# Altium schematic sheet MCU1.SchDoc
size A4; SheetNumber: 1; SheetTotal: 2
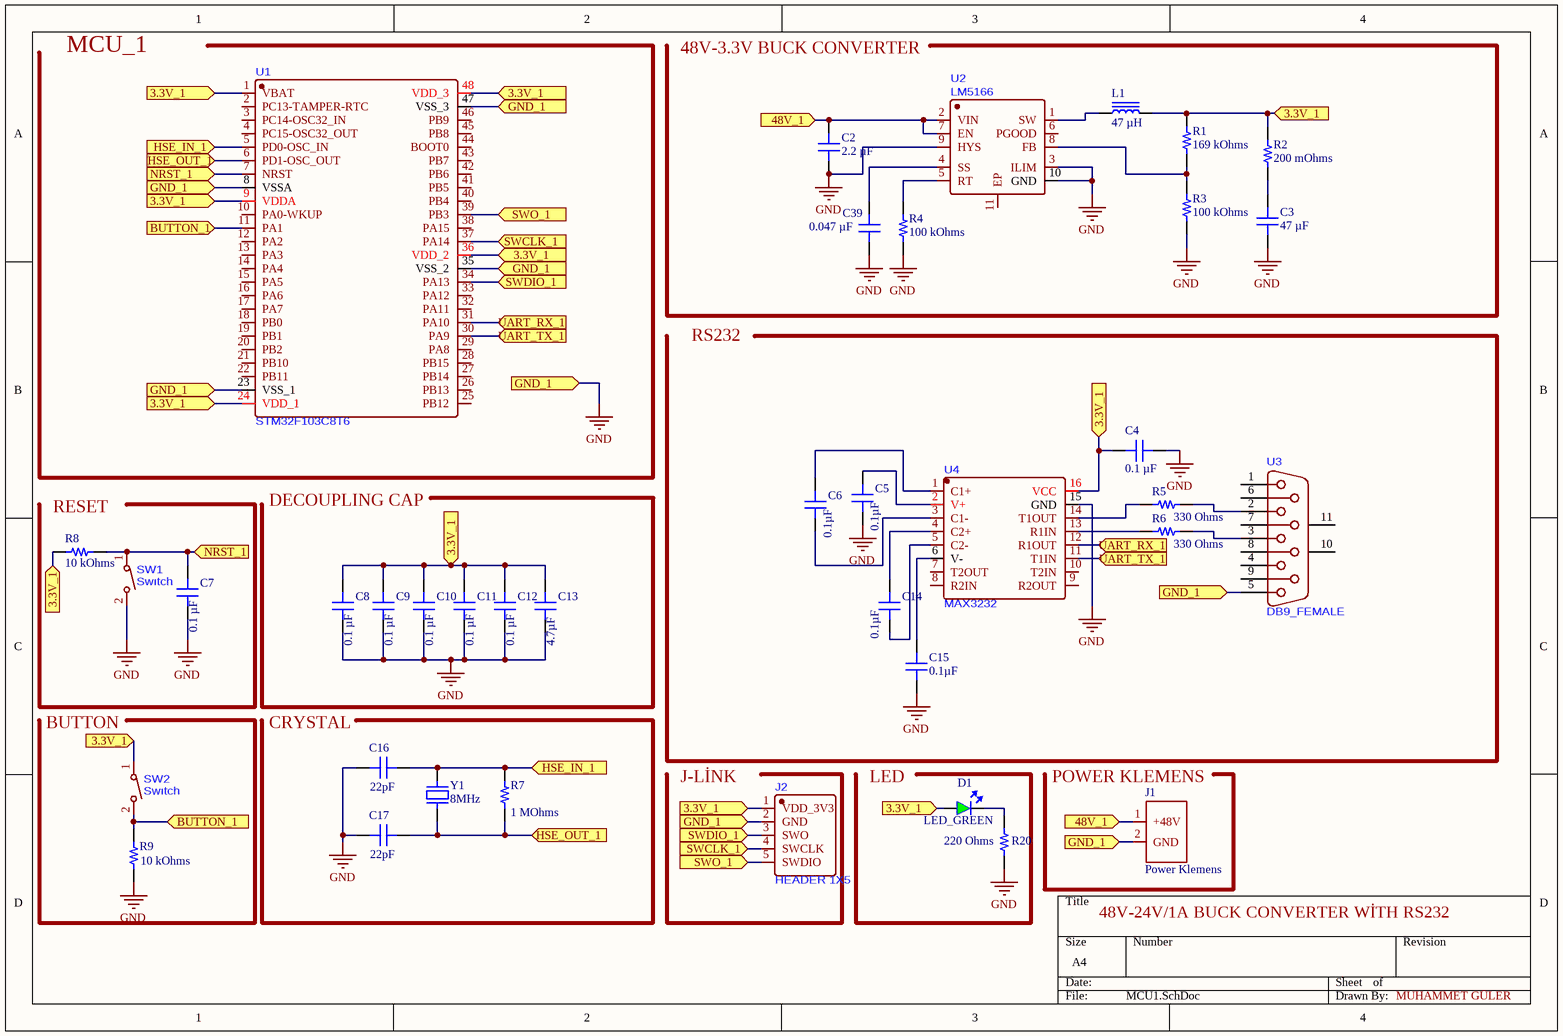
[diagram p0: MCU1.SchDoc]

## Parts
C2  2.2 µF  [CAP 1210_3225 - 1MM]
C3  47 µF  [CAP 1210_3225 - 1MM]
C4  0.1 µF  [CAP 0603_1608]
C5  0.1µF  [CAP 0603_1608]
C6  0.1µF  [CAP 0603_1608]
C7  0.1 µF  [CAP 0603_1608]
C8  0.1 µF  [CAP 0603_1608]
C9  0.1 µF  [CAP 0603_1608]
C10  0.1 µF  [CAP 0603_1608]
C11  0.1 µF  [CAP 0603_1608]
C12  0.1 µF  [CAP 0603_1608]
C13  4.7µF  [CAP 0603_1608]
C14  0.1µF  [CAP 0603_1608]
C15  0.1µF  [CAP 0603_1608]
C16  22pF  [CAP 0603_1608]
C17  22pF  [CAP 0603_1608]
C39  0.047 µF  [CAP 0402_1005]
D1  LED_GREEN  [LED_GREEN]
J1  Power Klemens  [PCBComponent_1]
J2  HEADER 1X5  [1X5-PIN-HEADER-2.54MM_ES]
L1  47 µH  [TAIYO YUDEN NRS8030]
R1  169 kOhms  [RES 0402_1005]
R2  200 mOhms  [RES 0402_1005]
R3  100 kOhms  [RES 0402_1005]
R4  100 kOhms  [RES 0402_1005]
R5  330 Ohms  [RES 0603_1608]
R6  330 Ohms  [RES 0603_1608]
R7  1 MOhms  [RES 0603_1608]
R8  10 kOhms  [RES 0603_1608]
R9  10 kOhms  [RES 0603_1608]
R20  220 Ohms  [RES 0603_1608]
SW1  Swıtch  [SW-SMD_L4.0-W3.0-LS5.0]
SW2  Swıtch  [SW-SMD_L4.0-W3.0-LS5.0]
U1  STM32F103C8T6  [UFQFPN-48_STM32]
U2  LM5166  [VSON-10_L3.0-W3.0-P0.50-TL-EP-1]
U3  DB9_FEMALE  [DB9-TH_DB9F_C5164093]
U4  MAX3232  [SOP-16_L9.9-W3.9-P1.27-LS6.0-BL]
Y1  8MHz  [NDK NX8045GB]

## Ports
3.3V_1 (in, see MCU1[1A], MCU1[1B], MCU1[1C], MCU1[2A], MCU1[2C], MCU1[2D], MCU1[3B], MCU1[3D]), 3.3V_1 (in, see MCU1[1A], MCU1[1B], MCU1[1C], MCU1[2A], MCU1[2C], MCU1[2D], MCU1[3B], MCU1[3D], MCU1[4A]), 3.3V_1 (in, see MCU1[1A], MCU1[1B], MCU1[1C], MCU1[2A], MCU1[2C], MCU1[2D], MCU1[3B], MCU1[4A]), 3.3V_1 (in, see MCU1[1A], MCU1[1B], MCU1[1C], MCU1[2A], MCU1[2C], MCU1[2D], MCU1[3D], MCU1[4A]), 3.3V_1 (in, see MCU1[1A], MCU1[1B], MCU1[1C], MCU1[2A], MCU1[2C], MCU1[3B], MCU1[3D], MCU1[4A]), 3.3V_1 (in, see MCU1[1A], MCU1[1B], MCU1[1C], MCU1[2A], MCU1[2D], MCU1[3B], MCU1[3D], MCU1[4A]), 3.3V_1 (in, see MCU1[1A], MCU1[1C], MCU1[2A], MCU1[2C], MCU1[2D], MCU1[3B], MCU1[3D], MCU1[4A]), 48V_1 (in, see MCU1[2A]), 48V_1 (in, see MCU1[3D]), BUTTON_1 (in, see MCU1[1A]), BUTTON_1 (in, see MCU1[1D]), GND_1 (in, see MCU1[1A], MCU1[1B], MCU1[2A], MCU1[2B], MCU1[2D], MCU1[3C]), GND_1 (in, see MCU1[1A], MCU1[1B], MCU1[2A], MCU1[2B], MCU1[2D], MCU1[3C], MCU1[3D]), GND_1 (in, see MCU1[1A], MCU1[1B], MCU1[2A], MCU1[2B], MCU1[2D], MCU1[3D]), GND_1 (in, see MCU1[1A], MCU1[1B], MCU1[2A], MCU1[2B], MCU1[3C], MCU1[3D]), GND_1 (in, see MCU1[1A], MCU1[1B], MCU1[2B], MCU1[2D], MCU1[3C], MCU1[3D]), GND_1 (in, see MCU1[1A], MCU1[2A], MCU1[2B], MCU1[2D], MCU1[3C], MCU1[3D]), GND_1 (in, see MCU1[1B], MCU1[2A], MCU1[2B], MCU1[2D], MCU1[3C], MCU1[3D]), HSE_IN_1 (in, see MCU1[1A]), HSE_IN_1 (in, see MCU1[2C]), HSE_OUT_1 (in, see MCU1[1A]), HSE_OUT_1 (in, see MCU1[2D]), NRST_1 (in, see MCU1[1A]), NRST_1 (in, see MCU1[1C]), SWCLK_1 (in, see MCU1[2A]), SWCLK_1 (in, see MCU1[2D]), SWDIO_1 (in, see MCU1[2B]), SWDIO_1 (in, see MCU1[2D]), SWO_1 (in, see MCU1[2A]), SWO_1 (in, see MCU1[2D]), UART_RX_1 (in, see MCU1[2B]), UART_RX_1 (in, see MCU1[3C]), UART_TX_1 (in, see MCU1[2B]), UART_TX_1 (in, see MCU1[3C])

## Nets
GND: C2.1 C3.1 C4.1 C5.1 C7.1 C8.1 C9.1 C10.1 C11.1 C12.1 C13.1 C15.1 C16.1 C17.1 C39.1 J1.2(GND) J2.2(GND) R3.1 R4.1 R9.1 R20.1 SW1.2 U1.8(VSSA) U1.23(VSS_1) U1.35(VSS_2) U1.47(VSS_3) U2.3(ILIM) U2.9(HYS) U2.10(GND) U3.5 U4.15(GND) ; port GND_1
3.3V_1: C4.2 C8.2 C9.2 C10.2 C11.2 C12.2 C13.2 D1.1(IN) J2.1(VDD_3V3) L1.2 R1.2 R2.2 R8.2 SW2.1 U1.1(VBAT) U1.9(VDDA) U1.24(VDD_1) U1.36(VDD_2) U1.48(VDD_3) U4.16(VCC) ; port 3.3V_1
48V_1: C2.2 J1.1(+48V) U2.2(VIN) U2.7(EN) ; port 48V_1
BUTTON_1: R9.2 SW2.2 U1.11(PA1) ; port BUTTON_1
HSE_IN_1: C16.2 R7.2 U1.5(PD0-OSC_IN) Y1.2 ; port HSE_IN_1
HSE_OUT_1: C17.2 R7.1 U1.6(PD1-OSC_OUT) Y1.1 ; port HSE_OUT_1
NRST_1: C7.2 R8.1 SW1.1 U1.7(NRST) ; port NRST_1
SWCLK_1: J2.4(SWCLK) U1.37(PA14) ; port SWCLK_1
SWDIO_1: J2.3(SWO) U1.34(PA13) ; port SWDIO_1
SWO_1: J2.5(SWDIO) U1.39(PB3) ; port SWO_1
UART_RX_1: U1.31(PA10) U4.12(R1OUT) ; port UART_RX_1
UART_TX_1: U1.30(PA9) U4.11(T1IN) ; port UART_TX_1
NetC3_2: C3.2 R2.1
NetC5_2: C5.2 U4.2(V+)
NetC6_1: C6.1 U4.3(C1-)
NetC6_2: C6.2 U4.1(C1+)
NetC14_1: C14.1 U4.5(C2-)
NetC14_2: C14.2 U4.4(C2+)
NetC15_2: C15.2 U4.6(V-)
NetC39_2: C39.2 U2.4(SS)
NetD1_2: D1.2(OUT) R20.2
NetL1_1: L1.1 U2.1(SW)
NetR1_1: R1.1 R3.2 U2.8(FB)
NetR4_2: R4.2 U2.5(RT)
NetR5_1: R5.1 U4.14(T1OUT)
NetR5_2: R5.2 U3.2
NetR6_1: R6.1 U4.13(R1IN)
NetR6_2: R6.2 U3.3

Not connected (* = marked no-connect by the designer): U1 2(PC13-TAMPER-RTC) 3(PC14-OSC32_IN) 4(PC15-OSC32_OUT) 10(PA0-WKUP) 12(PA2) 13(PA3) 14(PA4) 15(PA5) 16(PA6) 17(PA7) 18(PB0) 19(PB1) 20(PB2) 21(PB10) 22(PB11) 25(PB12) 26(PB13) 27(PB14) 28(PB15) 29(PA8) 32(PA11) 33(PA12) 38(PA15) 40(PB4) 41(PB5) 42(PB6) 43(PB7) 44(BOOT0) 45(PB8) 46(PB9); U2 6(PGOOD) 11(EP); U3 1 4 6 7 8 9 10(MH1) 11(MH2); U4 7(T2OUT) 8(R2IN) 9(R2OUT) 10(T2IN)

## Notes on the sheet
- MCU_1
- 48V-3.3V BUCK CONVERTER
- RS232
- (near R8) RESET
- DECOUPLING CAP
- (near SW2) BUTTON
- (near C16) CRYSTAL
- (near J2) J-LİNK
- LED
- (near J1) POWER KLEMENS
- 48V-24V/1A BUCK CONVERTER WİTH RS232
- MUHAMMET GÜLER

## Library data of the parts
C2 = 1210BB225K101NGX085T: CAP CER 2.2UF 100V X7R 1210; manufacturer: Knowles Novacap; Tolerance: ±10%; Part Number: 1210BB225K101NGX085T; Value: 2.2 µF; Applications: General Purpose; Capacitance: 2.2 µF; componentlink1description: Datasheet; componentlink1url: https://www.knowlescapacitors.com/getattachment/6c8d48ef-fc2b-4752-ae2c-ce6c208de0c4/High-Capacitance-Chip.aspx; componentlink2description: DigiKey Link; componentlink2url: https://www.digikey.com/en/products/detail/knowles-novacap/1210BB225K101NGX085T/7304028; Device Package: 1210 (3225 Metric); Features: Gold Flash Termination; lastupdated: 9.02.2024 20:44:47; Lifecycle Status: Active; Minimum Order: 1; Mounting Type: Surface Mount, MLCC; Operating Temperature: -55°C ~ 125°C; Package / Case: 1210 (3225 Metric); packaging: TapeAndReel; partid: 24765; Part Status: Active; price: 3.04; series: -; Size / Dimension: 0.125" L x 0.100" W (3.18mm x 2.54mm); Supplier 1: DigiKey; Supplier Part Number 1: 1763-1136-1-ND; Temperature Coefficient: X7R; Thickness (Max): 0.065" (1.65mm); Voltage - Rated: 100V
C3 = 885012109007: CAP CER 47UF 10V X5R 1210; manufacturer: Würth Elektronik; Tolerance: ±20%; Part Number: 885012109007; Value: 47 µF; Applications: General Purpose; Capacitance: 47 µF; componentlink1description: Datasheet; componentlink1url: https://katalog.we-online.de/pbs/datasheet/885012109007.pdf; componentlink2description: DigiKey Link; componentlink2url: https://www.digikey.com/en/products/detail/würth-elektronik/885012109007/5453233; Device Package: 1210 (3225 Metric); lastupdated: 9.02.2024 20:44:53; Lifecycle Status: Active; Minimum Order: 1; Mounting Type: Surface Mount, MLCC; Operating Temperature: -55°C ~ 85°C; Package / Case: 1210 (3225 Metric); packaging: TapeAndReel; partid: 44953; Part Status: Active; price: 0.47; series: WCAP-CSGP; Size / Dimension: 0.126" L x 0.098" W (3.20mm x 2.50mm); Supplier 1: DigiKey; Supplier Part Number 1: 732-7378-1-ND; Temperature Coefficient: X5R; Thickness (Max): 0.110" (2.80mm); Voltage - Rated: 10V
C4 = 6R3X14W104MV4T: CAP CER 0.1UF 6.3V X7R 0603; manufacturer: Johanson Dielectrics Inc.; Tolerance: ±20%; Part Number: 6R3X14W104MV4T; Value: 0.1 µF; Applications: Bypass, Decoupling; Capacitance: 0.1 µF; componentlink1description: Datasheet; componentlink1url: https://www.johansondielectrics.com/downloads/x2y-filter-and-decoupling-capacitors.pdf; componentlink2description: DigiKey Link; componentlink2url: https://www.digikey.com/en/products/detail/johanson-dielectrics-inc/6R3X14W104MV4T/1556331; Device Package: 0603 (1608 Metric); Features: Low ESL (X2Y); lastupdated: 9.02.2024 20:10:30; Lifecycle Status: Active; Minimum Order: 1; Mounting Type: Surface Mount, MLCC; Operating Temperature: -55°C ~ 125°C; Package / Case: 0603 (1608 Metric); packaging: TapeAndReel; partid: 2650; Part Status: Active; price: 0.08; series: X2Y®; Size / Dimension: 0.064" L x 0.035" W (1.63mm x 0.89mm); Supplier 1: DigiKey; Supplier Part Number 1: 709-1009-1-ND; Temperature Coefficient: X7R; Thickness (Max): 0.026" (0.66mm); Voltage - Rated: 6.3V
C5 C6 C14 C15 = 0603YC104MAT2A: CAP CER 0.1UF 16V X7R 0603; manufacturer: AVX Corporation; Tolerance: ±20%; Part Number: 0603YC104MAT2A; Value: 0.1µF; Applications: General Purpose; Capacitance: 0.1µF; componentlink1description: Datasheet; componentlink1url: http://datasheets.avx.com/X7RDielectric.pdf; componentlink2description: DigiKey Link; componentlink2url: http://digikey.com/product-detail/en/avx-corporation/0603YC104MAT2A/478-3727-1-ND/1116425; Device Package: 0603 (1608 Metric); lastupdated: 2.09.2020 01:03:32; Lifecycle Status: Active; Minimum Order: 1; Mounting Type: Surface Mount, MLCC; Operating Temperature: -55°C ~ 125°C; Package / Case: 0603 (1608 Metric); packaging: TapeAndReel; partid: 4371; Part Status: Active; price: 0.01; series: -; Size / Dimension: 0.063" L x 0.032" W (1.60mm x 0.81mm); Supplier 1: DigiKey; Supplier Part Number 1: 478-3727-1-ND; Temperature Coefficient: X7R; Thickness (Max): 0.035" (0.90mm); Voltage - Rated: 16V
C7-C12 = 6R3X14W104MV4T: CAP CER 0.1UF 6.3V X7R 0603; Part Number: 6R3X14W104MV4T; Value: 0.1 µF
C13 = 06036D475KAT4A: CAP CER 4.7UF 6.3V X5R 0603; Part Number: 06036D475KAT4A; Value: 4.7µF
C16 C17 = 06036A220J4T2A: CAP CER 22PF 6.3V NP0 0603; Part Number: 06036A220J4T2A; Value: 22pF
C39 = C0402C473K3REC7867: CAP CER 0402 47NF 16V X7R 10%; manufacturer: KEMET; Voltage - Rated: 25V; Part Number: C0402C473K3REC7867; Value: 0.047 µF; Applications: ESD Protection; Capacitance: 0.047 µF; componentlink1description: Datasheet; componentlink1url: https://api.kemet.com/component-edge/download/datasheet/C0402C473K3REC7867.pdf; componentlink2description: DigiKey Link; componentlink2url: https://www.digikey.com/en/products/detail/kemet/C0402C473K3REC7867/8643594; Device Package: 0402 (1005 Metric); lastupdated: 9.02.2024 20:04:15; Lifecycle Status: Active; Minimum Order: 1; Mounting Type: Surface Mount, MLCC; Operating Temperature: -55°C ~ 125°C; Package / Case: 0402 (1005 Metric); packaging: TapeAndReel; partid: 33555; Part Status: Active; price: 0.01; series: ESD SMD Comm X7R; Size / Dimension: 0.039" L x 0.020" W (1.00mm x 0.50mm); Supplier 1: DigiKey; Supplier Part Number 1: 399-C0402C473K3REC7867CT-ND; Temperature Coefficient: X7R; Thickness (Max): 0.022" (0.55mm); Tolerance: ±10%
J2 = HEADER 1X5 COPY
L1 = NRS8030T470MJGJ: FIXED IND 47UH 1.3A 221 MOHM SMD; Manufacturer: Taiyo Yuden; Current - Saturation: 1.1A; DC Resistance (DCR): 221mOhm Max; Frequency - Self Resonant: 11MHz; Inductance Frequency - Test: 100 kHz; Material - Core: Ferrite; Shielding: Shielded; Tolerance: ±20%; Type: Drum Core, Wirewound; Part Number: NRS8030T470MJGJ; ComponentLink1Description: Datasheet; ComponentLink1URL: https://www.yuden.co.jp/productdata/catalog/wound04_e.pdf; ComponentLink2Description: DigiKey Link; ComponentLink2URL: https://www.digikey.com/en/products/detail/taiyo-yuden/NRS8030T470MJGJ/2666006; Current Rating (Amps): 1.3 A; Device Package: Nonstandard; Height - Seated (Max): 0.118" (3.00mm); Inductance: 47 µH; LastUpdated: 8.02.2024 21:55:48; Lifecycle Status: Active; Minimum Order: 1; Mounting Type: Surface Mount; Operating Temperature: -25°C ~ 125°C; Package / Case: Nonstandard; Packaging: TapeAndReel; PartId: 5487; Part Status: Active; Price: 0.16; Series: NR, S Type; Size / Dimension: 0.315" L x 0.315" W (8.00mm x 8.00mm); Supplier 1: DigiKey; Supplier Part Number 1: 587-2968-1-ND; Value: 47 µH
R1 = RC0402FR-07169KL: RES 169K OHM 1% 1/16W 0402; Manufacturer: Yageo; Power (Watts): 0.063W, 1/16W; Temperature Coefficient: ±100ppm/°C; Part Number: RC0402FR-07169KL; Value: 169 kOhms; ComponentLink1Description: Datasheet; ComponentLink1URL: https://www.yageo.com/upload/media/product/productsearch/datasheet/rchip/PYu-RC_Group_51_RoHS_L_10.pdf; ComponentLink2Description: DigiKey Link; ComponentLink2URL: https://www.digikey.com/en/products/detail/yageo/RC0402FR-07169KL/5280860; Composition: Thick Film; Device Package: 0402 (1005 Metric); Features: Moisture Resistant; Height - Seated (Max): 0.016" (0.40mm); LastUpdated: 9.02.2024 20:30:22; Lifecycle Status: Active; Minimum Order: 1; Number of Terminations: 2; Operating Temperature: -55°C ~ 155°C; Package / Case: 0402 (1005 Metric); Packaging: CutTape; PartId: 2821; Part Status: Active; Price: 0.01; Resistance: 169 kOhms; Series: RC_L; Size / Dimension: 0.039" L x 0.020" W (1.00mm x 0.50mm); Supplier 1: DigiKey; Supplier Part Number 1: YAG3000CT-ND; Supplier Device Package: 0402; Tolerance: ±1%
R2 = MFL0402R2000FP: RES 0.2 OHM 1% 1/16W 0402; Manufacturer: Eaton - Electronics Division; Power (Watts): 0.063W, 1/16W; Temperature Coefficient: ±300ppm/°C; Part Number: MFL0402R2000FP; Value: 200 mOhms; ComponentLink1Description: Datasheet; ComponentLink1URL: https://www.eaton.com/content/dam/eaton/products/electronic-components/resources/data-sheet/eaton-mfl-smd-current-sense-resistor-metal-film-data-sheet-elx1181.pdf; ComponentLink2Description: DigiKey Link; ComponentLink2URL: https://www.digikey.com/en/products/detail/eaton-electronics-division/MFL0402R2000FP/16713385; Composition: Metal Film; Device Package: 0402 (1005 Metric); Features: Current Sense, Moisture Resistant; Height - Seated (Max): 0.016" (0.40mm); LastUpdated: 9.02.2024 20:28:43; Lifecycle Status: Active; Minimum Order: 1; Number of Terminations: 2; Operating Temperature: -55°C ~ 155°C; Package / Case: 0402 (1005 Metric); Packaging: TapeAndReel; PartId: 70238; Part Status: Active; Price: 0.03; Resistance: 200 mOhms; Series: MFL; Size / Dimension: 0.039" L x 0.020" W (1.00mm x 0.50mm); Supplier 1: DigiKey; Supplier Part Number 1: 283-MFL0402R2000FPCT-ND; Supplier Device Package: 0402; Tolerance: ±1%
R3 R4 = AC0402JR-07100KL: RES SMD 100K OHM 5% 1/16W 0402; Manufacturer: Yageo; Power (Watts): 0.063W, 1/16W; Temperature Coefficient: ±100ppm/°C; Part Number: AC0402JR-07100KL; Value: 100 kOhms; ComponentLink1Description: Datasheet; ComponentLink1URL: https://www.yageo.com/upload/media/product/productsearch/datasheet/rchip/PYu-AC_51_RoHS_L_7.pdf; ComponentLink2Description: DigiKey Link; ComponentLink2URL: https://www.digikey.com/en/products/detail/yageo/AC0402JR-07100KL/5895569; Composition: Thick Film; Device Package: 0402 (1005 Metric); Features: Automotive AEC-Q200, Moisture Resistant; Height - Seated (Max): 0.015" (0.37mm); LastUpdated: 9.02.2024 20:30:20; Lifecycle Status: Active; Minimum Order: 1; Number of Terminations: 2; Operating Temperature: -55°C ~ 155°C; Package / Case: 0402 (1005 Metric); Packaging: CutTape; PartId: 3380; Part Status: Active; Price: 0.01; Ratings: AEC-Q200; Resistance: 100 kOhms; Series: AC; Size / Dimension: 0.039" L x 0.020" W (1.00mm x 0.50mm); Supplier 1: DigiKey; Supplier Part Number 1: YAG3515CT-ND; Supplier Device Package: 0402; Tolerance: ±5%
R5 R6 = CRGH0603F330R: RES SMD 330 OHM 1% 1/5W 0603; Manufacturer: TE Connectivity Passive Product; Power (Watts): 0.2W, 1/5W; Temperature Coefficient: ±100ppm/°C; Part Number: CRGH0603F330R; Value: 330 Ohms; ComponentLink1Description: Datasheet; ComponentLink1URL: https://www.te.com/commerce/DocumentDelivery/DDEController?Action=srchrtrv&DocNm=1773204-1&DocType=DS&DocLang=English; ComponentLink2Description: DigiKey Link; ComponentLink2URL: https://www.digikey.com/en/products/detail/te-connectivity-passive-product/CRGH0603F330R/5586961; Composition: Thick Film; Device Package: 0603 (1608 Metric); Height - Seated (Max): 0.022" (0.55mm); LastUpdated: 9.02.2024 20:43:33; Lifecycle Status: Active; Minimum Order: 1; Number of Terminations: 2; Operating Temperature: -55°C ~ 155°C; Package / Case: 0603 (1608 Metric); Packaging: TapeAndReel; PartId: 5733; Part Status: Active; Price: 0.01; Resistance: 330 Ohms; Series: CRGH, Neohm; Size / Dimension: 0.063" L x 0.031" W (1.60mm x 0.80mm); Supplier 1: DigiKey; Supplier Part Number 1: A129541CT-ND; Supplier Device Package: 0603; Tolerance: ±1%
R7 = RT0603FRE071ML: RES SMD 1M OHM 1% 1/10W 0603; Part Number: RT0603FRE071ML; Value: 1 MOhms
R8 = RNCS0603BKE10K0: RES 10K OHM 0.1% 1/16W 0603; Manufacturer: Stackpole Electronics Inc; Power (Watts): 0.063W, 1/16W; Temperature Coefficient: ±25ppm/°C; Part Number: RNCS0603BKE10K0; Value: 10 kOhms; ComponentLink1Description: Datasheet; ComponentLink1URL: https://www.seielect.com/catalog/sei-rncs_rnch.pdf; ComponentLink2Description: DigiKey Link; ComponentLink2URL: https://www.digikey.com/en/products/detail/stackpole-electronics-inc/RNCS0603BKE10K0/1708836; Composition: Thin Film; Device Package: 0603 (1608 Metric); Features: Anti-Corrosive, Automotive AEC-Q200, Moisture Resistant; Height - Seated (Max): 0.022" (0.55mm); LastUpdated: 9.02.2024 20:43:37; Lifecycle Status: Active; Minimum Order: 1; Number of Terminations: 2; Operating Temperature: -55°C ~ 155°C; Package / Case: 0603 (1608 Metric); Packaging: TapeAndReel; PartId: 4838; Part Status: Active; Price: 0.06; Ratings: AEC-Q200; Resistance: 10 kOhms; Series: RNCS; Size / Dimension: 0.061" L x 0.031" W (1.55mm x 0.80mm); Supplier 1: DigiKey; Supplier Part Number 1: RNCS0603BKE10K0CT-ND; Supplier Device Package: 0603; Tolerance: ±0.1%
R9 = CPF0603B10KE: RES SMD 10K OHM 0.1% 1/16W 0603; Part Number: CPF0603B10KE; Value: 10 kOhms
R20 = CRCW0603220RJNEAHP: RES SMD 220 OHM 5% 1/3W 0603; Manufacturer: Vishay Dale; Power (Watts): 0.333W, 1/3W; Temperature Coefficient: ±200ppm/°C; Part Number: CRCW0603220RJNEAHP; Value: 220 Ohms; ComponentLink1Description: Datasheet; ComponentLink1URL: http://www.vishay.com/docs/20043/crcwhpe3.pdf; ComponentLink2Description: DigiKey Link; ComponentLink2URL: https://www.digikey.com/en/products/detail/vishay-dale/CRCW0603220RJNEAHP/2222292; Composition: Thick Film; Device Package: 0603 (1608 Metric); Features: Automotive AEC-Q200, Pulse Withstanding; Height - Seated (Max): 0.022" (0.55mm); LastUpdated: 9.02.2024 20:43:28; Lifecycle Status: Active; Minimum Order: 1; Number of Terminations: 2; Operating Temperature: -55°C ~ 155°C; Package / Case: 0603 (1608 Metric); Packaging: TapeAndReel; PartId: 6998; Part Status: Active; Price: 0.01; Ratings: AEC-Q200; Resistance: 220 Ohms; Series: CRCW-HP; Size / Dimension: 0.063" L x 0.033" W (1.60mm x 0.85mm); Supplier 1: DigiKey; Supplier Part Number 1: 541-220SACT-ND; Supplier Device Package: 0603; Tolerance: ±5%
U2 = LM5166DRCR
U3 = 5745781-4
U4 = MAX3232ESE-MS
Y1 = NX8045GB-8.000M-STD-CSF-4: CRYSTAL 8.0000MHZ 8PF SMD; Manufacturer: NDK America, Inc.; ESR (Equivalent Series Resistance): 200 Ohms; Frequency Stability: ±30ppm; Frequency Tolerance: ±20ppm; Operating Mode: Fundamental; Part Number: NX8045GB-8.000M-STD-CSF-4; ComponentLink1Description: Datasheet; ComponentLink1URL: http://www.ndk.com/images/products/catalog/c_NX8045GB-STD-CSF-4_e.pdf; ComponentLink2Description: DigiKey Link; ComponentLink2URL: http://digikey.com/product-detail/en/ndk-america-inc/NX8045GB-8.000M-STD-CSF-4/644-1279-1-ND/5023011; Frequency: 8MHz; Height - Seated (Max): 0.079" (2.00mm); LastUpdated: 8.02.2024 21:34:41; Lifecycle Status: Active; Load Capacitance: 8pF; Minimum Order: 1; Mounting Type: Surface Mount; Operating Temperature: -10°C ~ 70°C; Package / Case: 2-SMD, No Lead; Packaging: TapeAndReel; PartId: 639; Part Status: Active; Price: 0.40; Series: NX8045GB; Size / Dimension: 0.315" L x 0.177" W (8.00mm x 4.50mm); Supplier 1: DigiKey; Supplier Part Number 1: 644-1279-1-ND; Type: MHz Crystal; Value: 8MHz